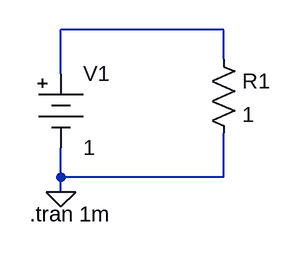
[diagram p0: schematic Yoneda-p26_t1.asc]
Yoneda-p26_t1.asc, the LTspice schematic file:
Version 4
SHEET 1 880 680
WIRE 256 48 80 48
WIRE 256 80 256 48
WIRE 80 96 80 48
WIRE 80 208 80 176
WIRE 256 208 256 160
WIRE 256 208 80 208
WIRE 80 224 80 208
FLAG 80 224 0
SYMBOL Misc\\battery 80 80 R0
SYMATTR InstName V1
SYMATTR Value 1
SYMBOL res 240 64 R0
SYMATTR InstName R1
SYMATTR Value 1
TEXT 46 248 Left 2 !.tran 1m

The netlist it stands for:
* Yoneda-p26_t1.asc
V1 N001 0 1
R1 N001 0 1
.tran 1m
.backanno
.end